# Altium schematic sheet EVK-IRIS-W1-FC0_FC1_JTAG_UCX.SchDoc: Top Level Design
size A3; CompanyName: Rigado, LLC; Organization: Rigado; DocumentNumber: 4; SheetNumber: 4; SheetTotal: 14; Website: www.rigado.com; SheetSize: B
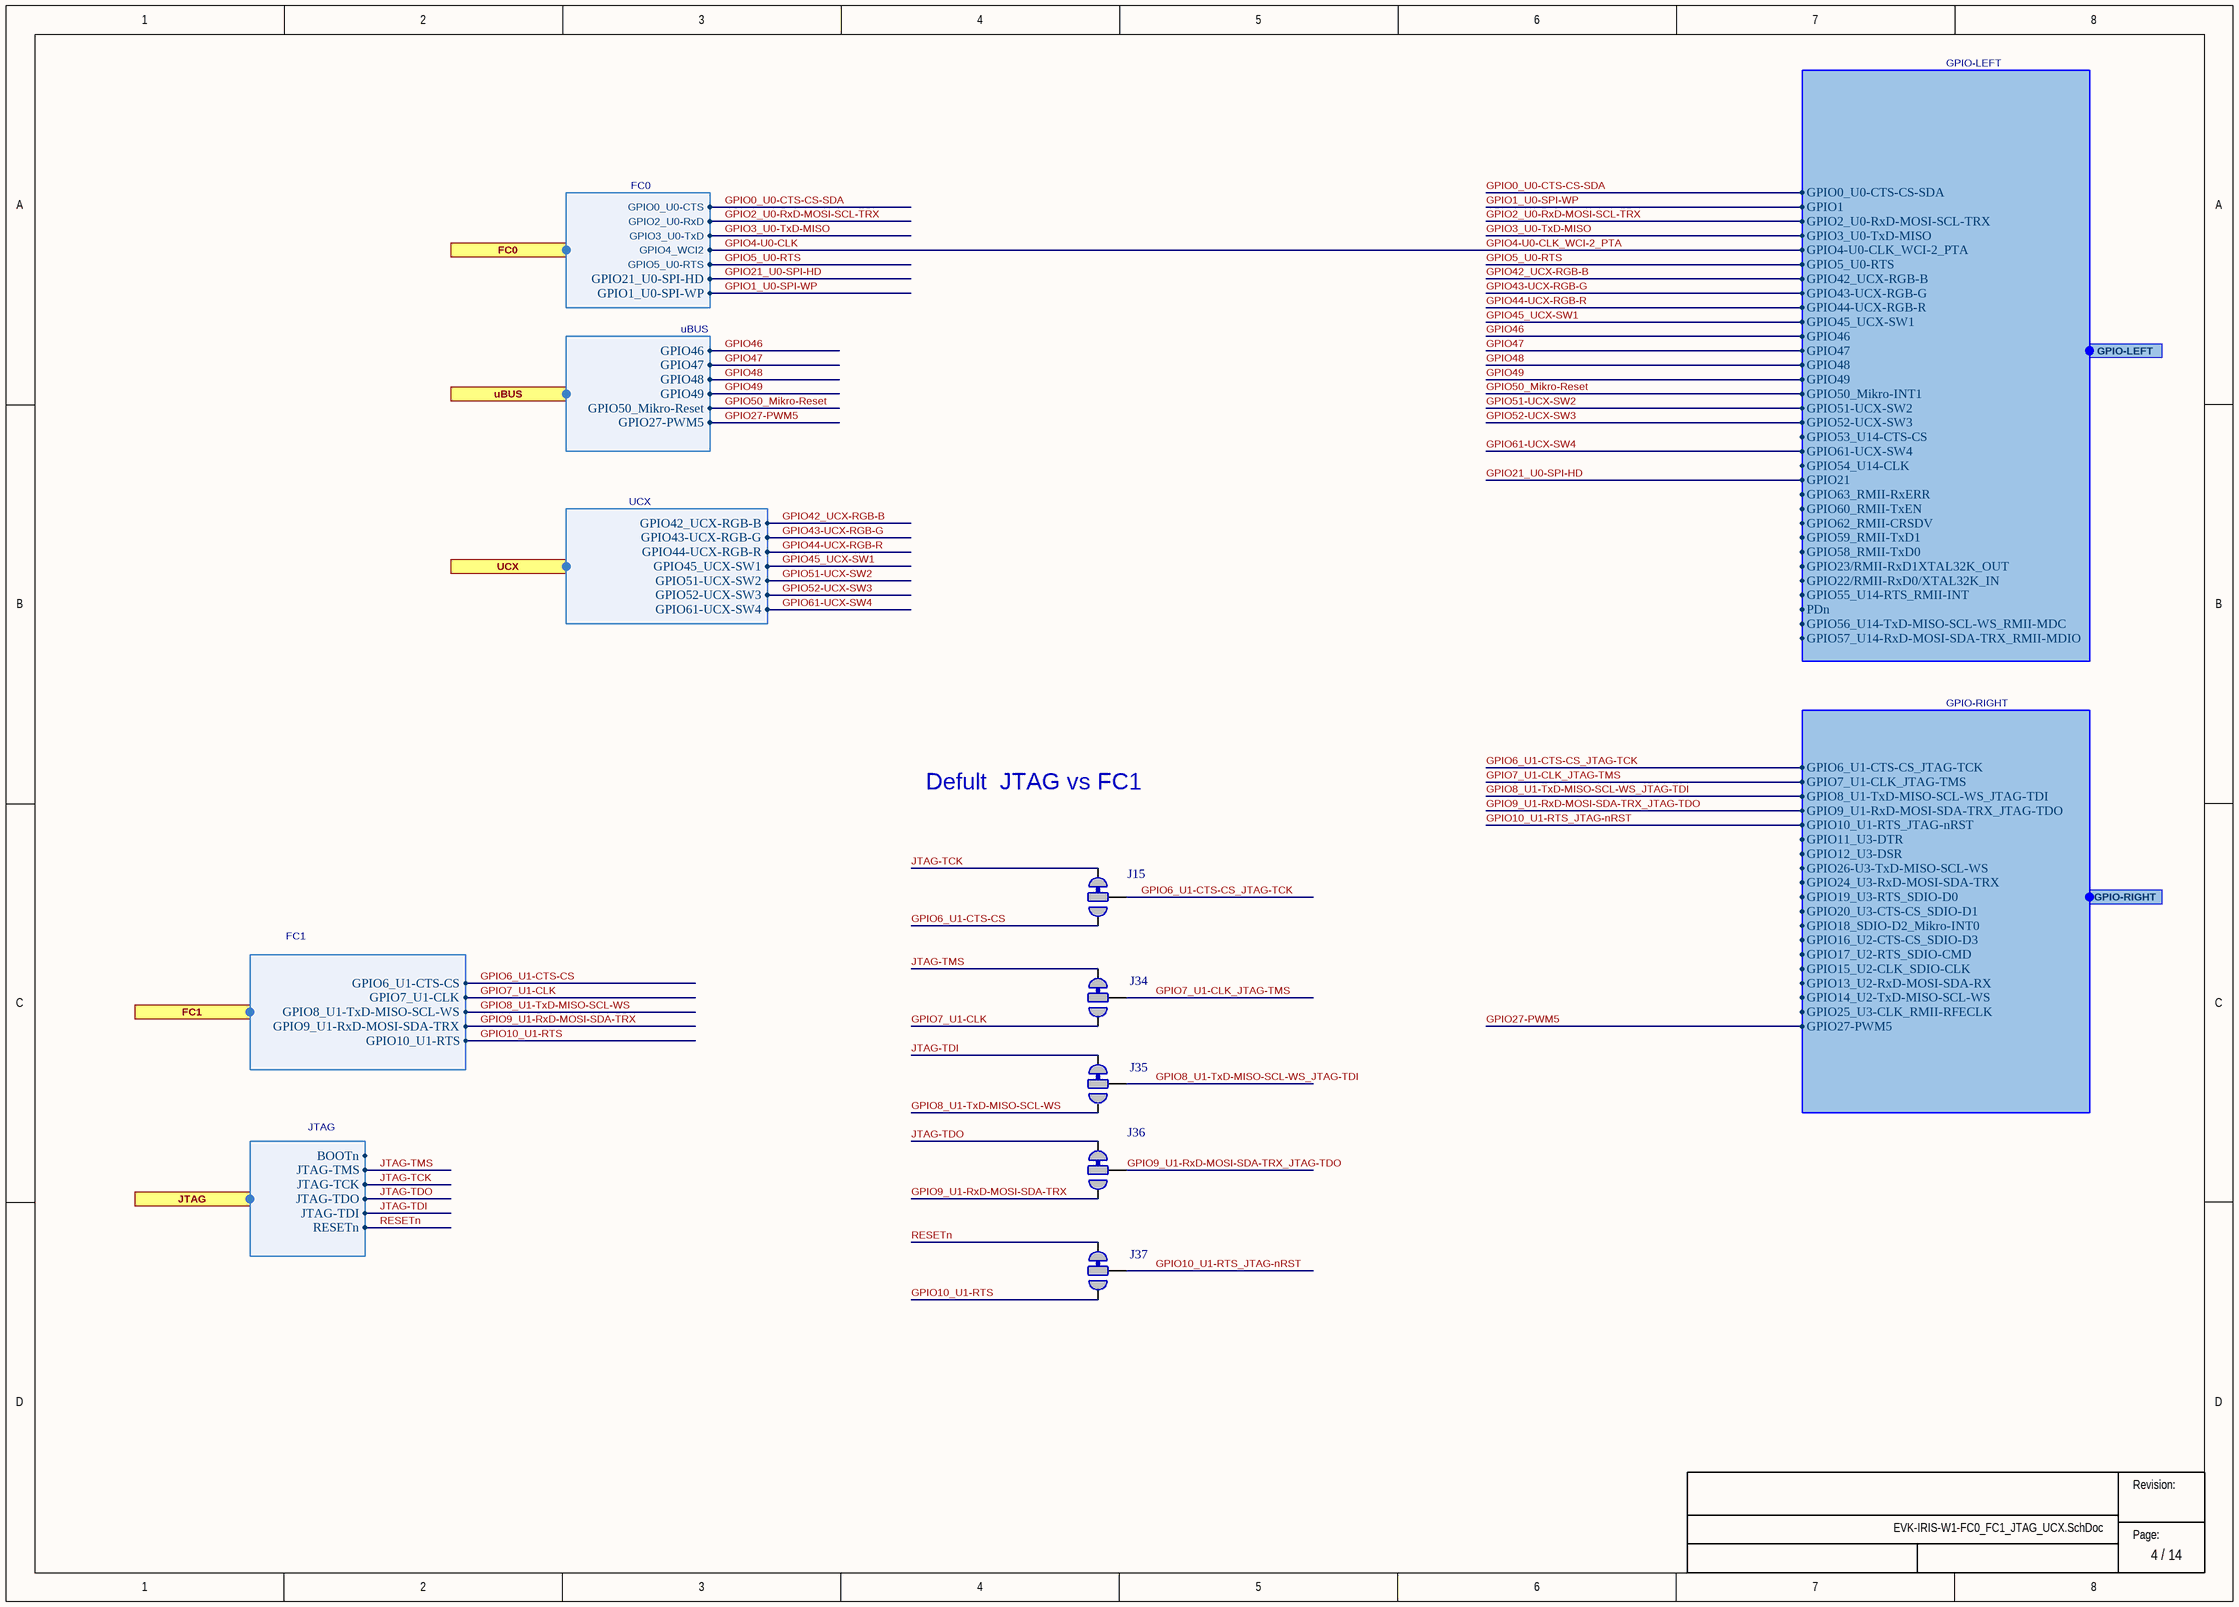
[diagram p0: EVK-IRIS-W1-FC0_FC1_JTAG_UCX.SchDoc]

## Parts
J15  Solderbridge-OptionDNP  [Solderbridge-Option]  (value not drawn)  (net tie, no BOM)
J34  Solderbridge-OptionDNP  [Solderbridge-Option]  (value not drawn)  (net tie, no BOM)
J35  Solderbridge-OptionDNP  [Solderbridge-Option]  (value not drawn)  (net tie, no BOM)
J36  Solderbridge-OptionDNP  [Solderbridge-Option]  (value not drawn)  (net tie, no BOM)
J37  Solderbridge-OptionDNP  [Solderbridge-Option]  (value not drawn)  (net tie, no BOM)

## Ports
FC0 (harness FC0), FC1 (harness FC1), GPIO-LEFT (harness GPIO-LEFT), GPIO-RIGHT (harness GPIO-RIGHT), JTAG (harness JTAG), uBUS (harness uBUS), UCX (harness UCX)

## Harnesses
GPIO-RIGHT: GPIO6_U1-CTS-CS_JTAG-TCK, GPIO7_U1-CLK_JTAG-TMS, GPIO8_U1-TxD-MISO-SCL-WS_JTAG-TDI, GPIO9_U1-RxD-MOSI-SDA-TRX_JTAG-TDO, GPIO10_U1-RTS_JTAG-nRST, GPIO11_U3-DTR, GPIO12_U3-DSR, GPIO26-U3-TxD-MISO-SCL-WS, GPIO24_U3-RxD-MOSI-SDA-TRX, GPIO19_U3-RTS_SDIO-D0, GPIO20_U3-CTS-CS_SDIO-D1, GPIO18_SDIO-D2_Mikro-INT0, GPIO16_U2-CTS-CS_SDIO-D3, GPIO17_U2-RTS_SDIO-CMD, GPIO15_U2-CLK_SDIO-CLK, GPIO13_U2-RxD-MOSI-SDA-RX, GPIO14_U2-TxD-MISO-SCL-WS, GPIO25_U3-CLK_RMII-RFECLK, GPIO27-PWM5
JTAG: JTAG-TCK, JTAG-TDI, JTAG-TDO, JTAG-TMS, RESETn, BOOTn
FC1: GPIO6_U1-CTS-CS, GPIO7_U1-CLK, GPIO8_U1-TxD-MISO-SCL-WS, GPIO9_U1-RxD-MOSI-SDA-TRX, GPIO10_U1-RTS
FC0: GPIO0_U0-CTS, GPIO2_U0-RxD, GPIO3_U0-TxD, GPIO5_U0-RTS, GPIO4_WCI2, GPIO21_U0-SPI-HD, GPIO1_U0-SPI-WP
UCX: GPIO42_UCX-RGB-B, GPIO43-UCX-RGB-G, GPIO44-UCX-RGB-R, GPIO45_UCX-SW1, GPIO51-UCX-SW2, GPIO52-UCX-SW3, GPIO61-UCX-SW4
uBUS: GPIO46, GPIO47, GPIO48, GPIO49, GPIO50_Mikro-Reset, GPIO27-PWM5
GPIO-LEFT: GPIO0_U0-CTS-CS-SDA, GPIO1, GPIO2_U0-RxD-MOSI-SCL-TRX, GPIO3_U0-TxD-MISO, GPIO4-U0-CLK_WCI-2_PTA, GPIO5_U0-RTS, GPIO42_UCX-RGB-B, GPIO43-UCX-RGB-G, GPIO44-UCX-RGB-R, GPIO45_UCX-SW1, GPIO46, GPIO47, GPIO48, GPIO49, GPIO50_Mikro-INT1, GPIO51-UCX-SW2, GPIO52-UCX-SW3, GPIO53_U14-CTS-CS, GPIO61-UCX-SW4, GPIO54_U14-CLK, GPIO21, GPIO63_RMII-RxERR, GPIO60_RMII-TxEN, GPIO62_RMII-CRSDV, GPIO59_RMII-TxD1, GPIO58_RMII-TxD0, GPIO23/RMII-RxD1XTAL32K_OUT, GPIO22/RMII-RxD0/XTAL32K_IN, GPIO55_U14-RTS_RMII-INT, PDn, GPIO56_U14-TxD-MISO-SCL-WS_RMII-MDC, GPIO57_U14-RxD-MOSI-SDA-TRX_RMII-MDIO

## Nets
GPIO0_U0-CTS-CS-SDA: port FC0.GPIO0_U0-CTS, port GPIO-LEFT.GPIO0_U0-CTS-CS-SDA
GPIO1_U0-SPI-WP: port FC0.GPIO1_U0-SPI-WP, port GPIO-LEFT.GPIO1
GPIO2_U0-RxD-MOSI-SCL-TRX: port FC0.GPIO2_U0-RxD, port GPIO-LEFT.GPIO2_U0-RxD-MOSI-SCL-TRX
GPIO3_U0-TxD-MISO: port FC0.GPIO3_U0-TxD, port GPIO-LEFT.GPIO3_U0-TxD-MISO
GPIO4-U0-CLK: port FC0.GPIO4_WCI2, port GPIO-LEFT.GPIO4-U0-CLK_WCI-2_PTA  [also labelled GPIO4-U0-CLK_WCI-2_PTA]
GPIO5_U0-RTS: port GPIO-LEFT.GPIO5_U0-RTS
GPIO6_U1-CTS-CS: J15.3 ; port FC1.GPIO6_U1-CTS-CS
GPIO6_U1-CTS-CS_JTAG-TCK: J15.2 ; port GPIO-RIGHT.GPIO6_U1-CTS-CS_JTAG-TCK
GPIO7_U1-CLK: J34.3 ; port FC1.GPIO7_U1-CLK
GPIO7_U1-CLK_JTAG-TMS: J34.2 ; port GPIO-RIGHT.GPIO7_U1-CLK_JTAG-TMS
GPIO8_U1-TxD-MISO-SCL-WS: J35.3 ; port FC1.GPIO8_U1-TxD-MISO-SCL-WS
GPIO8_U1-TxD-MISO-SCL-WS_JTAG-TDI: J35.2 ; port GPIO-RIGHT.GPIO8_U1-TxD-MISO-SCL-WS_JTAG-TDI
GPIO9_U1-RxD-MOSI-SDA-TRX: J36.3 ; port FC1.GPIO9_U1-RxD-MOSI-SDA-TRX
GPIO9_U1-RxD-MOSI-SDA-TRX_JTAG-TDO: J36.2 ; port GPIO-RIGHT.GPIO9_U1-RxD-MOSI-SDA-TRX_JTAG-TDO
GPIO10_U1-RTS: J37.3 ; port FC1.GPIO10_U1-RTS
GPIO10_U1-RTS_JTAG-nRST: J37.2 ; port GPIO-RIGHT.GPIO10_U1-RTS_JTAG-nRST
GPIO21_U0-SPI-HD: port FC0.GPIO21_U0-SPI-HD, port GPIO-LEFT.GPIO21
GPIO27-PWM5: port GPIO-RIGHT.GPIO27-PWM5, port uBUS.GPIO27-PWM5
GPIO42_UCX-RGB-B: port UCX.GPIO42_UCX-RGB-B, port GPIO-LEFT.GPIO42_UCX-RGB-B
GPIO43-UCX-RGB-G: port UCX.GPIO43-UCX-RGB-G, port GPIO-LEFT.GPIO43-UCX-RGB-G
GPIO44-UCX-RGB-R: port UCX.GPIO44-UCX-RGB-R, port GPIO-LEFT.GPIO44-UCX-RGB-R
GPIO45_UCX-SW1: port UCX.GPIO45_UCX-SW1, port GPIO-LEFT.GPIO45_UCX-SW1
GPIO46: port uBUS.GPIO46, port GPIO-LEFT.GPIO46
GPIO47: port uBUS.GPIO47, port GPIO-LEFT.GPIO47
GPIO48: port uBUS.GPIO48, port GPIO-LEFT.GPIO48
GPIO49: port uBUS.GPIO49, port GPIO-LEFT.GPIO49
GPIO50_Mikro-Reset: port uBUS.GPIO50_Mikro-Reset, port GPIO-LEFT.GPIO50_Mikro-INT1
GPIO51-UCX-SW2: port UCX.GPIO51-UCX-SW2, port GPIO-LEFT.GPIO51-UCX-SW2
GPIO52-UCX-SW3: port UCX.GPIO52-UCX-SW3, port GPIO-LEFT.GPIO52-UCX-SW3
GPIO61-UCX-SW4: port UCX.GPIO61-UCX-SW4, port GPIO-LEFT.GPIO61-UCX-SW4
JTAG-TCK: J15.1 ; port JTAG.JTAG-TCK
JTAG-TDI: J35.1 ; port JTAG.JTAG-TDI
JTAG-TDO: J36.1 ; port JTAG.JTAG-TDO
JTAG-TMS: J34.1 ; port JTAG.JTAG-TMS
RESETn: J37.1 ; port JTAG.RESETn

## Notes on the sheet
- Defult  JTAG vs FC1
- Revision:
- Page:

## Library data of the parts
J15 J34-J37 = Solderbridge-Option: Added By: Paul B; Part Number: Solderbridge-Option; Height: 0; DNP: DNP; Added Date: 2015-12-03